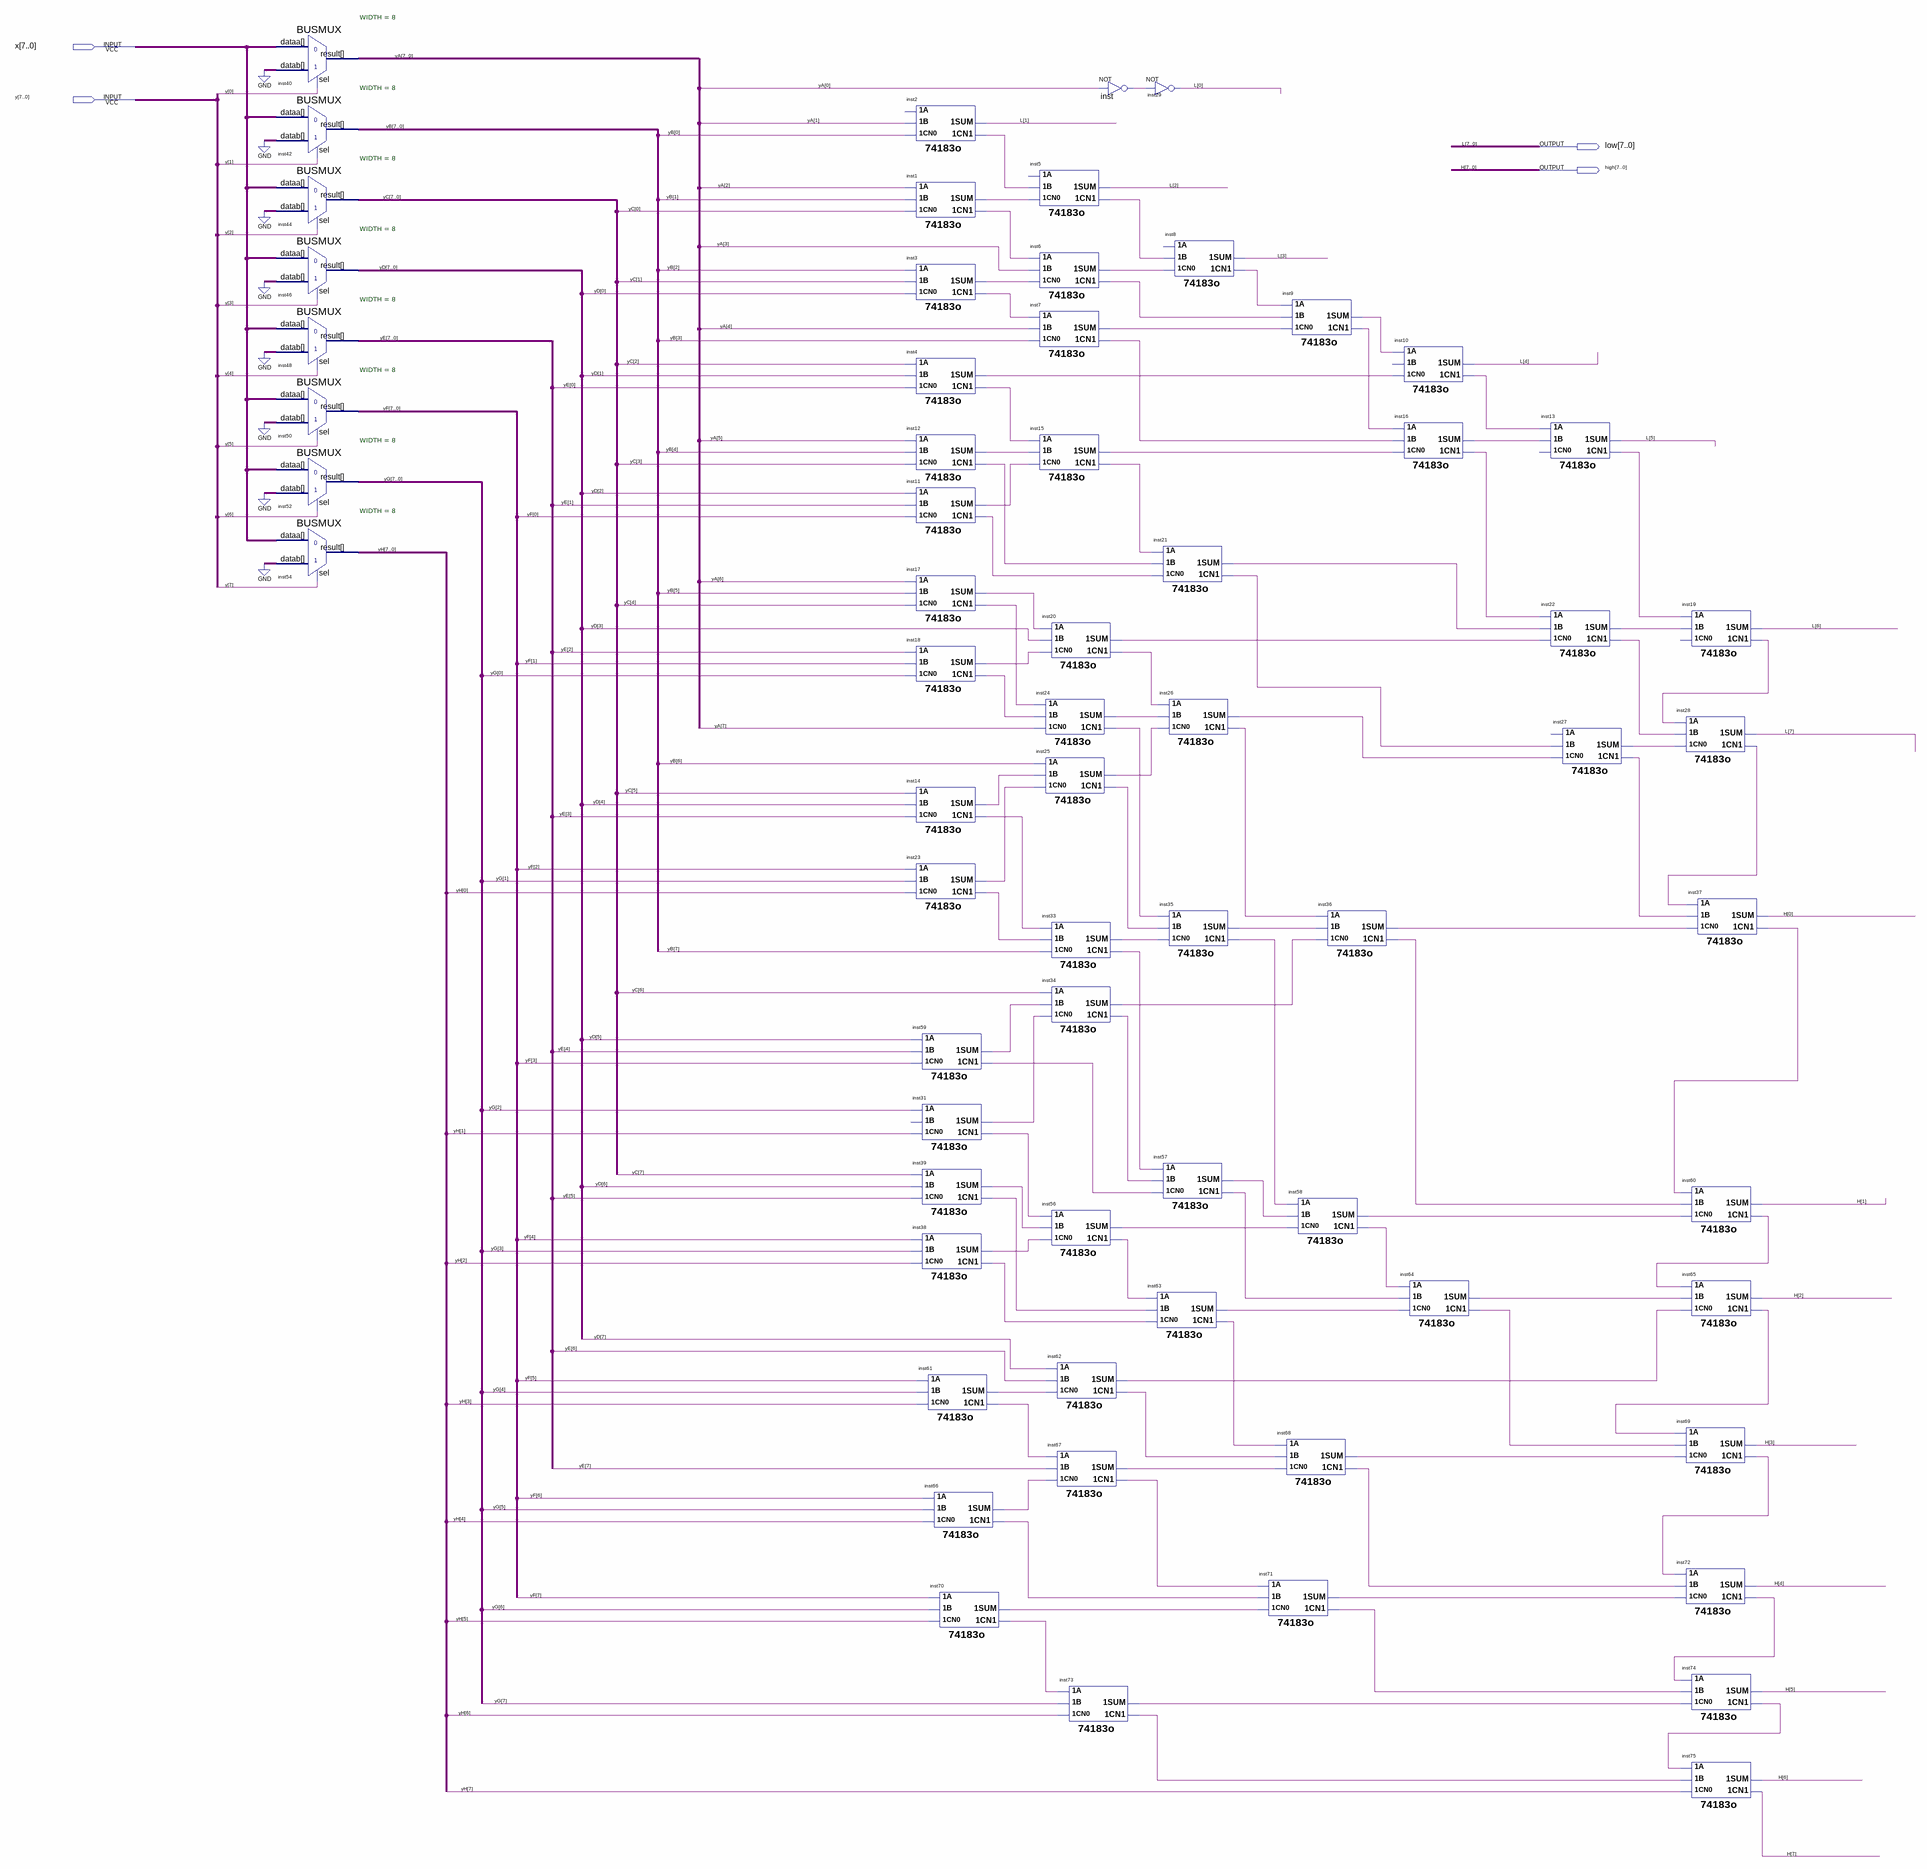
[diagram p0: schematic sheet]
// Quartus schematic mulH.bdf as structural Verilog: 66 symbols, 4 pins
module mulH (
  input  [7:0] x,
  input  [7:0] y,
  output [7:0] low,
  output [7:0] high
);

  wire inst1_1cn1, inst1_1sum, inst2_1cn1, inst3_1cn1, inst3_1sum, inst4_1cn1, inst4_1sum, inst5_1cn1,
       inst6_1cn1, inst6_1sum, inst7_1cn1, inst7_1sum, inst8_1cn1, inst9_1cn1, inst9_1sum, inst10_1cn1,
       inst11_1cn1, inst11_1sum, inst12_1cn1, inst12_1sum, inst13_1cn1, inst14_1cn1, inst14_1sum,
       inst15_1cn1, inst15_1sum, inst16_1cn1, inst16_1sum, inst17_1cn1, inst17_1sum, inst18_1cn1,
       inst18_1sum, inst19_1cn1, inst20_1cn1, inst20_1sum, inst21_1cn1, inst21_1sum, inst22_1cn1,
       inst22_1sum, inst23_1cn1, inst23_1sum, inst24_1cn1, inst24_1sum, inst25_1cn1, inst25_1sum,
       inst26_1cn1, inst26_1sum, inst27_1cn1, inst27_1sum, inst28_1cn1, inst31_1cn1, inst31_1sum,
       inst33_1cn1, inst33_1sum, inst34_1cn1, inst34_1sum, inst35_1cn1, inst35_1sum, inst36_1cn1,
       inst36_1sum, inst37_1cn1, inst38_1cn1, inst38_1sum, inst39_1cn1, inst39_1sum, inst56_1cn1,
       inst56_1sum, inst57_1cn1, inst57_1sum, inst58_1cn1, inst58_1sum, inst59_1cn1, inst59_1sum,
       inst60_1cn1, inst61_1cn1, inst61_1sum, inst62_1cn1, inst62_1sum, inst63_1cn1, inst63_1sum,
       inst64_1cn1, inst64_1sum, inst65_1cn1, inst66_1cn1, inst66_1sum, inst67_1cn1, inst67_1sum,
       inst68_1cn1, inst68_1sum, inst69_1cn1, inst70_1cn1, inst70_1sum, inst71_1cn1, inst71_1sum,
       inst72_1cn1, inst73_1cn1, inst73_1sum, inst74_1cn1, inst_out;
  wire [7:0] yA, yB, yC, yD, yE, yF, yG, yH;

  BUSMUX #(.WIDTH(8)) inst40 (.datab({8{1'b0}}), .sel(y[0]), .dataa(x), .result(yA));
  BUSMUX #(.WIDTH(8)) inst42 (.datab({8{1'b0}}), .sel(y[1]), .dataa(x), .result(yB));
  BUSMUX #(.WIDTH(8)) inst44 (.datab({8{1'b0}}), .sel(y[2]), .dataa(x), .result(yC));
  BUSMUX #(.WIDTH(8)) inst46 (.datab({8{1'b0}}), .sel(y[3]), .dataa(x), .result(yD));
  BUSMUX #(.WIDTH(8)) inst48 (.datab({8{1'b0}}), .sel(y[4]), .dataa(x), .result(yE));
  BUSMUX #(.WIDTH(8)) inst50 (.datab({8{1'b0}}), .sel(y[5]), .dataa(x), .result(yF));
  BUSMUX #(.WIDTH(8)) inst52 (.datab({8{1'b0}}), .sel(y[6]), .dataa(x), .result(yG));
  BUSMUX #(.WIDTH(8)) inst54 (.datab({8{1'b0}}), .sel(y[7]), .dataa(x), .result(yH));
  \74183o  inst2 (.\1CN0 (yB[0]), .\1B (yA[1]), .\1CN1 (inst2_1cn1), .\1SUM (low[1]));  // open: 1A
  \74183o  inst1 (.\1CN0 (yC[0]), .\1A (yA[2]), .\1B (yB[1]), .\1CN1 (inst1_1cn1), .\1SUM (inst1_1sum));
  \74183o  inst3 (.\1CN0 (yD[0]), .\1A (yB[2]), .\1B (yC[1]), .\1CN1 (inst3_1cn1), .\1SUM (inst3_1sum));
  \74183o  inst4 (.\1CN0 (yE[0]), .\1A (yC[2]), .\1B (yD[1]), .\1CN1 (inst4_1cn1), .\1SUM (inst4_1sum));
  \74183o  inst12 (.\1CN0 (yC[3]), .\1A (yA[5]), .\1B (yB[4]), .\1CN1 (inst12_1cn1), .\1SUM (inst12_1sum));
  \74183o  inst11 (.\1CN0 (yF[0]), .\1A (yD[2]), .\1B (yE[1]), .\1CN1 (inst11_1cn1), .\1SUM (inst11_1sum));
  \74183o  inst17 (.\1CN0 (yC[4]), .\1A (yA[6]), .\1B (yB[5]), .\1CN1 (inst17_1cn1), .\1SUM (inst17_1sum));
  \74183o  inst18 (.\1CN0 (yG[0]), .\1A (yE[2]), .\1B (yF[1]), .\1CN1 (inst18_1cn1), .\1SUM (inst18_1sum));
  \74183o  inst14 (.\1CN0 (yE[3]), .\1A (yC[5]), .\1B (yD[4]), .\1CN1 (inst14_1cn1), .\1SUM (inst14_1sum));
  \74183o  inst23 (.\1CN0 (yH[0]), .\1A (yF[2]), .\1B (yG[1]), .\1CN1 (inst23_1cn1), .\1SUM (inst23_1sum));
  \74183o  inst59 (.\1CN0 (yF[3]), .\1A (yD[5]), .\1B (yE[4]), .\1CN1 (inst59_1cn1), .\1SUM (inst59_1sum));
  \74183o  inst31 (.\1CN0 (yH[1]), .\1A (yG[2]), .\1CN1 (inst31_1cn1), .\1SUM (inst31_1sum));  // open: 1B
  \74183o  inst39 (.\1CN0 (yE[5]), .\1A (yC[7]), .\1B (yD[6]), .\1CN1 (inst39_1cn1), .\1SUM (inst39_1sum));
  \74183o  inst38 (.\1CN0 (yH[2]), .\1A (yF[4]), .\1B (yG[3]), .\1CN1 (inst38_1cn1), .\1SUM (inst38_1sum));
  \74183o  inst61 (.\1CN0 (yH[3]), .\1A (yF[5]), .\1B (yG[4]), .\1CN1 (inst61_1cn1), .\1SUM (inst61_1sum));
  \74183o  inst66 (.\1CN0 (yH[4]), .\1A (yF[6]), .\1B (yG[5]), .\1CN1 (inst66_1cn1), .\1SUM (inst66_1sum));
  \74183o  inst70 (.\1CN0 (yH[5]), .\1A (yF[7]), .\1B (yG[6]), .\1CN1 (inst70_1cn1), .\1SUM (inst70_1sum));
  \74183o  inst5 (.\1CN0 (inst1_1sum), .\1B (inst2_1cn1), .\1CN1 (inst5_1cn1), .\1SUM (low[2]));  // open: 1A
  \74183o  inst6 (.\1CN0 (inst3_1sum), .\1A (inst1_1cn1), .\1B (yA[3]), .\1CN1 (inst6_1cn1), .\1SUM (inst6_1sum));
  \74183o  inst7 (.\1CN0 (yB[3]), .\1A (inst3_1cn1), .\1B (yA[4]), .\1CN1 (inst7_1cn1), .\1SUM (inst7_1sum));
  \74183o  inst15 (
    .\1CN0 (inst11_1sum), .\1A (inst4_1cn1), .\1B (inst12_1sum), .\1CN1 (inst15_1cn1), .\1SUM (inst15_1sum));
  \74183o  inst20 (.\1CN0 (inst18_1sum), .\1A (inst17_1sum), .\1B (yD[3]), .\1CN1 (inst20_1cn1), .\1SUM (inst20_1sum));
  \74183o  inst24 (.\1CN0 (yA[7]), .\1A (inst17_1cn1), .\1B (inst18_1cn1), .\1CN1 (inst24_1cn1), .\1SUM (inst24_1sum));
  \74183o  inst25 (.\1CN0 (inst23_1sum), .\1A (yB[6]), .\1B (inst14_1sum), .\1CN1 (inst25_1cn1), .\1SUM (inst25_1sum));
  \74183o  inst33 (.\1CN0 (yB[7]), .\1A (inst14_1cn1), .\1B (inst23_1cn1), .\1CN1 (inst33_1cn1), .\1SUM (inst33_1sum));
  \74183o  inst34 (.\1CN0 (inst31_1sum), .\1A (yC[6]), .\1B (inst59_1sum), .\1CN1 (inst34_1cn1), .\1SUM (inst34_1sum));
  \74183o  inst56 (
    .\1CN0 (inst38_1sum), .\1A (inst31_1cn1), .\1B (inst39_1sum), .\1CN1 (inst56_1cn1), .\1SUM (inst56_1sum));
  \74183o  inst62 (.\1CN0 (inst61_1sum), .\1A (yD[7]), .\1B (yE[6]), .\1CN1 (inst62_1cn1), .\1SUM (inst62_1sum));
  \74183o  inst67 (.\1CN0 (inst66_1sum), .\1A (inst61_1cn1), .\1B (yE[7]), .\1CN1 (inst67_1cn1), .\1SUM (inst67_1sum));
  \74183o  inst73 (.\1CN0 (yH[6]), .\1A (inst70_1cn1), .\1B (yG[7]), .\1CN1 (inst73_1cn1), .\1SUM (inst73_1sum));
  not inst (inst_out, yA[0]);
  not inst29 (low[0], inst_out);
  \74183o  inst21 (
    .\1CN0 (inst11_1cn1), .\1A (inst15_1cn1), .\1B (inst12_1cn1), .\1CN1 (inst21_1cn1), .\1SUM (inst21_1sum));
  \74183o  inst26 (
    .\1CN0 (inst25_1sum), .\1A (inst20_1cn1), .\1B (inst24_1sum), .\1CN1 (inst26_1cn1), .\1SUM (inst26_1sum));
  \74183o  inst35 (
    .\1CN0 (inst33_1sum), .\1A (inst24_1cn1), .\1B (inst25_1cn1), .\1CN1 (inst35_1cn1), .\1SUM (inst35_1sum));
  \74183o  inst57 (
    .\1CN0 (inst59_1cn1), .\1A (inst33_1cn1), .\1B (inst34_1cn1), .\1CN1 (inst57_1cn1), .\1SUM (inst57_1sum));
  \74183o  inst63 (
    .\1CN0 (inst38_1cn1), .\1A (inst56_1cn1), .\1B (inst39_1cn1), .\1CN1 (inst63_1cn1), .\1SUM (inst63_1sum));
  \74183o  inst8 (.\1CN0 (inst6_1sum), .\1B (inst5_1cn1), .\1CN1 (inst8_1cn1), .\1SUM (low[3]));  // open: 1A
  \74183o  inst9 (.\1CN0 (inst7_1sum), .\1A (inst8_1cn1), .\1B (inst6_1cn1), .\1CN1 (inst9_1cn1), .\1SUM (inst9_1sum));
  \74183o  inst58 (
    .\1CN0 (inst56_1sum), .\1A (inst35_1cn1), .\1B (inst57_1sum), .\1CN1 (inst58_1cn1), .\1SUM (inst58_1sum));
  \74183o  inst68 (
    .\1CN0 (inst67_1sum), .\1A (inst63_1cn1), .\1B (inst62_1cn1), .\1CN1 (inst68_1cn1), .\1SUM (inst68_1sum));
  \74183o  inst71 (
    .\1CN0 (inst70_1sum), .\1A (inst67_1cn1), .\1B (inst66_1cn1), .\1CN1 (inst71_1cn1), .\1SUM (inst71_1sum));
  \74183o  inst36 (
    .\1CN0 (inst34_1sum), .\1A (inst26_1cn1), .\1B (inst35_1sum), .\1CN1 (inst36_1cn1), .\1SUM (inst36_1sum));
  \74183o  inst10 (.\1CN0 (inst4_1sum), .\1A (inst9_1sum), .\1CN1 (inst10_1cn1), .\1SUM (low[4]));  // open: 1B
  \74183o  inst16 (
    .\1CN0 (inst15_1sum), .\1A (inst9_1cn1), .\1B (inst7_1cn1), .\1CN1 (inst16_1cn1), .\1SUM (inst16_1sum));
  \74183o  inst64 (
    .\1CN0 (inst63_1sum), .\1A (inst58_1cn1), .\1B (inst57_1cn1), .\1CN1 (inst64_1cn1), .\1SUM (inst64_1sum));
  \74183o  inst13 (.\1A (inst10_1cn1), .\1B (inst16_1sum), .\1CN1 (inst13_1cn1), .\1SUM (low[5]));  // open: 1CN0
  \74183o  inst22 (
    .\1CN0 (inst20_1sum), .\1A (inst16_1cn1), .\1B (inst21_1sum), .\1CN1 (inst22_1cn1), .\1SUM (inst22_1sum));
  \74183o  inst27 (.\1CN0 (inst26_1sum), .\1B (inst21_1cn1), .\1CN1 (inst27_1cn1), .\1SUM (inst27_1sum));  // open: 1A
  \74183o  inst28 (.\1CN0 (inst27_1sum), .\1A (inst19_1cn1), .\1B (inst22_1cn1), .\1CN1 (inst28_1cn1), .\1SUM (low[7]));
  \74183o  inst69 (
    .\1CN0 (inst68_1sum), .\1A (inst65_1cn1), .\1B (inst64_1cn1), .\1CN1 (inst69_1cn1), .\1SUM (high[3]));
  \74183o  inst72 (
    .\1CN0 (inst71_1sum), .\1A (inst69_1cn1), .\1B (inst68_1cn1), .\1CN1 (inst72_1cn1), .\1SUM (high[4]));
  \74183o  inst19 (.\1A (inst13_1cn1), .\1B (inst22_1sum), .\1CN1 (inst19_1cn1), .\1SUM (low[6]));  // open: 1CN0
  \74183o  inst37 (
    .\1CN0 (inst36_1sum), .\1A (inst28_1cn1), .\1B (inst27_1cn1), .\1CN1 (inst37_1cn1), .\1SUM (high[0]));
  \74183o  inst60 (
    .\1CN0 (inst58_1sum), .\1A (inst37_1cn1), .\1B (inst36_1cn1), .\1CN1 (inst60_1cn1), .\1SUM (high[1]));
  \74183o  inst65 (
    .\1CN0 (inst62_1sum), .\1A (inst60_1cn1), .\1B (inst64_1sum), .\1CN1 (inst65_1cn1), .\1SUM (high[2]));
  \74183o  inst74 (
    .\1CN0 (inst73_1sum), .\1A (inst72_1cn1), .\1B (inst71_1cn1), .\1CN1 (inst74_1cn1), .\1SUM (high[5]));
  \74183o  inst75 (.\1CN0 (yH[7]), .\1A (inst74_1cn1), .\1B (inst73_1cn1), .\1CN1 (high[7]), .\1SUM (high[6]));

  // Other names for the same wires on the sheet: H[7:0] = high; L[7:0] = low
endmodule
